# EAGLE schematic clock (EAGLE 6.1)
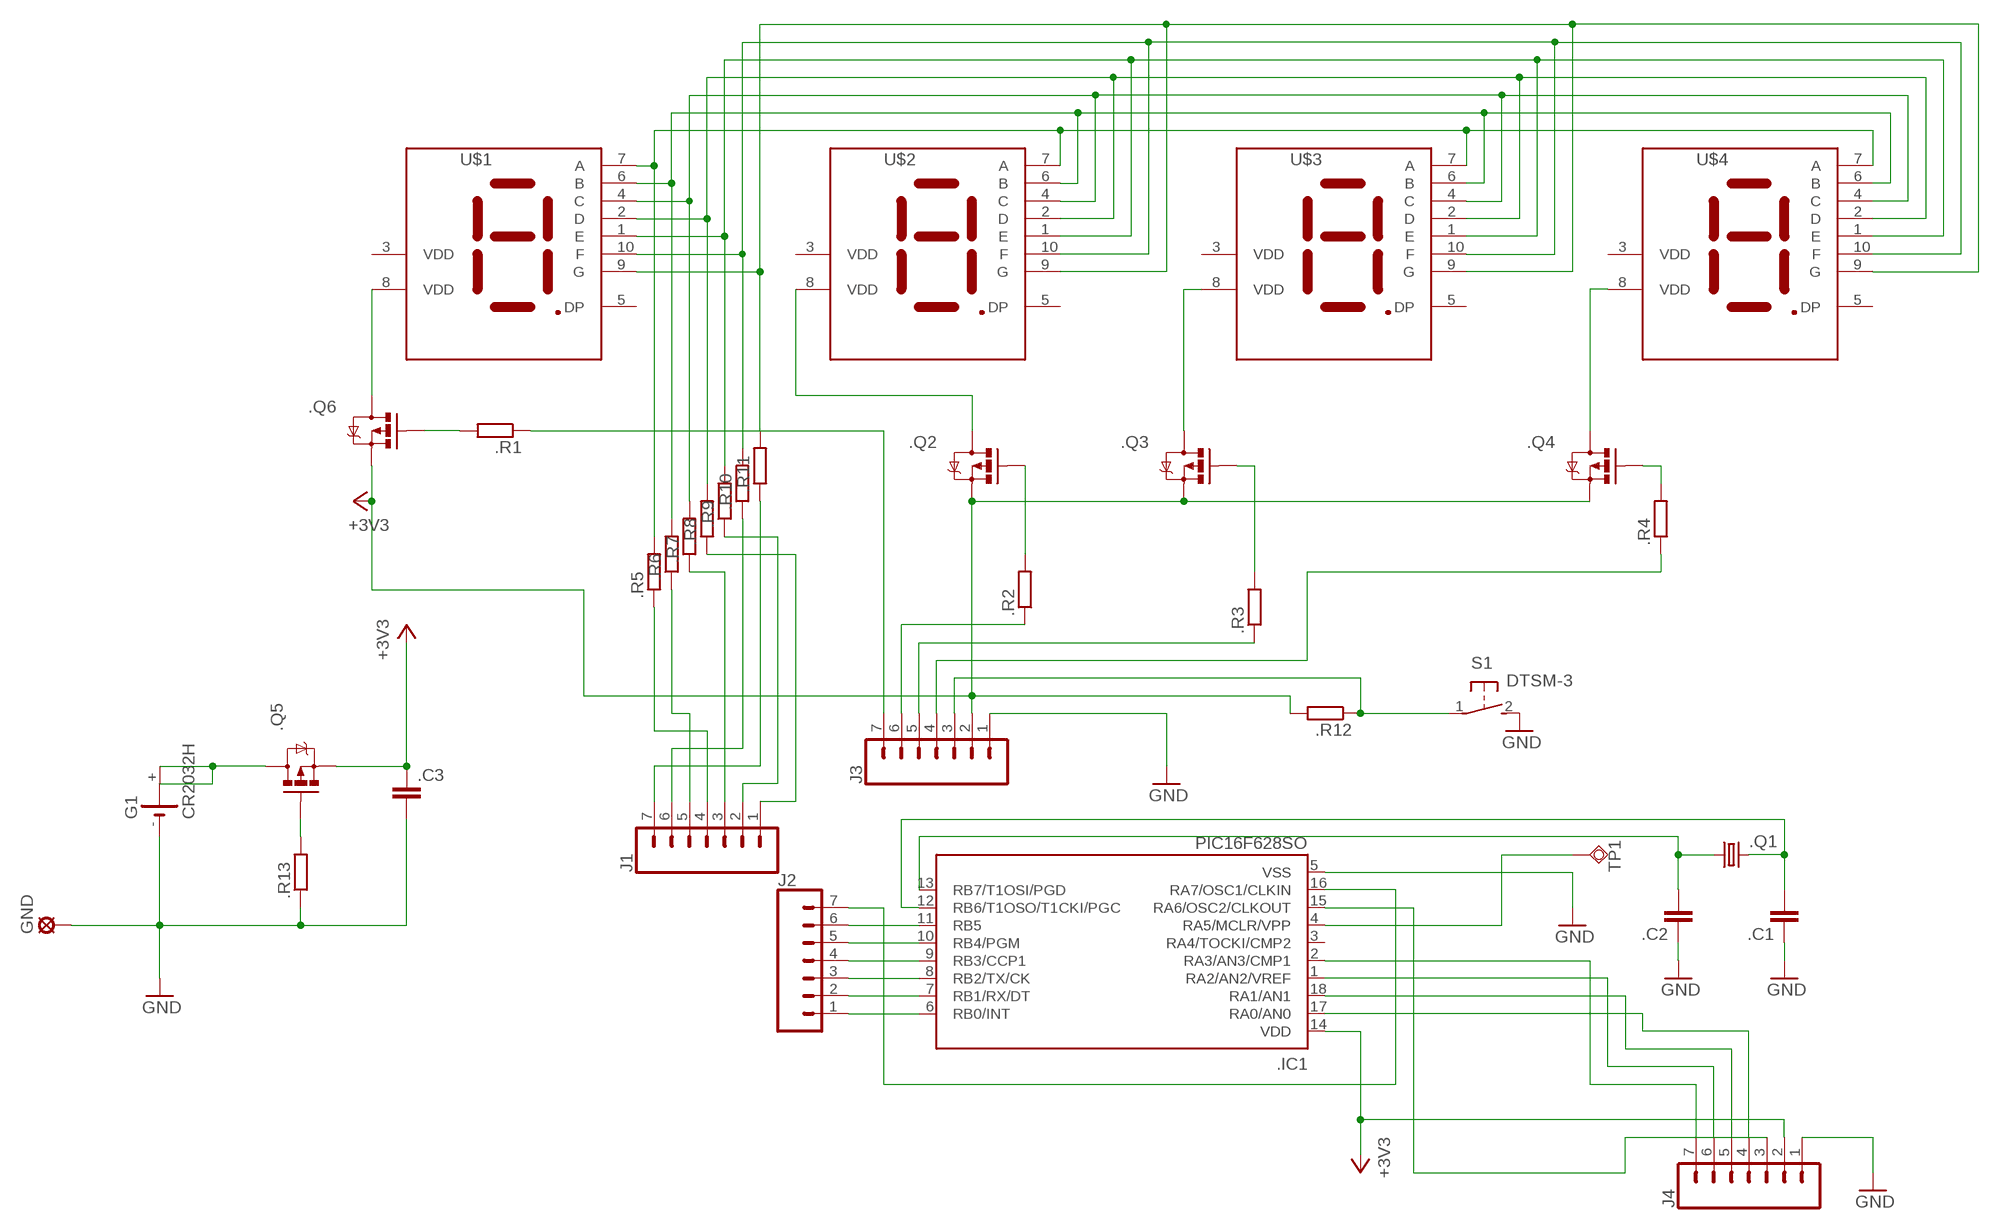
[diagram p0: schematic, sheet 1]

## Parts
.C1  C-EUC0805  [C0805]
.C2  C-EUC0805  [C0805]
.C3  C-EUC0805  [C0805]
.IC1  PIC16F628SO  [SO-18W]
.Q1  CRYSTALTC26H  [TC26H]
.Q2  MOSFET-PCHANNEL  [SOT23]
.Q3  MOSFET-PCHANNEL  [SOT23]
.Q4  MOSFET-PCHANNEL  [SOT23]
.Q5  MOSFET-PCHANNEL  [SOT23]
.Q6  MOSFET-PCHANNEL  [SOT23]
.R1  R-EU_R0805  [R0805]
.R2  R-EU_R0805  [R0805]
.R3  R-EU_R0805  [R0805]
.R4  R-EU_R0805  [R0805]
.R5  R-EU_R0805  [R0805]
.R6  R-EU_R0805  [R0805]
.R7  R-EU_R0805  [R0805]
.R8  R-EU_R0805  [R0805]
.R9  R-EU_R0805  [R0805]
.R10  R-EU_R0805  [R0805]
.R11  R-EU_R0805  [R0805]
.R12  R-EU_R0805  [R0805]
.R13  R-EU_R0805  [R0805]
G1  CR2032H  [CR2032H]
GND  SE14  [SE14]
J1  CONN_07  [1X07]
J2  CONN_07  [1X07]
J3  CONN_07  [1X07]
J4  CONN_07  [1X07]
S1  DTSM-3  [DTSM-3]
TP1  TPSQTP15R  [TP15R]
U$1  AL304G  [AL304G]
U$2  AL304G  [AL304G]
U$3  AL304G  [AL304G]
U$4  AL304G  [AL304G]

## Nets
+3V3: .Q2.2(S) .Q3.2(S) .Q4.2(S) .Q6.2(S) .R12.2 J3.2
GND: .C1.1 .C2.1 .C3.2 .IC1.5(VSS) .R13.1 G1.- GND.MP J3.1 J4.1 S1.2
MASK: .C3.1 .IC1.14(VDD) .Q5.2(S) J4.2 ; supply symbol labelled +3V3
N$1: .R5.2 U$1.7(A) U$2.7(A) U$3.7(A) U$4.7(A)
N$2: .R6.2 U$1.6(B) U$2.6(B) U$3.6(B) U$4.6(B)
N$3: .R7.2 U$1.4(C) U$2.4(C) U$3.4(C) U$4.4(C)
N$4: .R8.2 U$1.2(D) U$2.2(D) U$3.2(D) U$4.2(D)
N$5: .R9.2 U$1.1(E) U$2.1(E) U$3.1(E) U$4.1(E)
N$6: .R10.2 U$1.10(F) U$2.10(F) U$3.10(F) U$4.10(F)
N$7: .Q6.3(D) U$1.8(VDD)
N$8: .Q2.3(D) U$2.8(VDD)
N$9: .R11.2 U$1.9(G) U$2.9(G) U$3.9(G) U$4.9(G)
N$10: .Q3.3(D) U$3.8(VDD)
N$11: .C2.2 .IC1.13(RB7/T1OSI/PGD) .Q1.1
N$12: .C1.2 .IC1.12(RB6/T1OSO/T1CKI/PGC) .Q1.2
N$13: .Q4.3(D) U$4.8(VDD)
N$14: .R5.1 J1.4
N$15: .IC1.6(RB0/INT) J2.1
N$16: .IC1.7(RB1/RX/DT) J2.2
N$17: .IC1.8(RB2/TX/CK) J2.3
N$18: .IC1.9(RB3/CCP1) J2.4
N$19: .R6.1 J1.5
N$20: .R10.1 J1.6
N$21: .R11.1 J1.7
N$22: .R7.1 J1.3
N$23: .R9.1 J1.2
N$24: .R8.1 J1.1
N$25: .R1.1 J3.7
N$26: .R2.1 J3.6
N$27: .R3.1 J3.5
N$28: .R4.1 J3.4
N$29: .R12.1 J3.3 S1.1
N$30: .IC1.10(RB4/PGM) J2.5
N$31: .IC1.11(RB5) J2.6
N$32: .IC1.16(RA7/OSC1/CLKIN) J2.7
N$33: .Q6.1(G) .R1.2
N$36: .Q3.1(G) .R3.2
N$37: .IC1.17(RA0/AN0) J4.4
N$38: .IC1.18(RA1/AN1) J4.5
N$39: .IC1.1(RA2/AN2/VREF) J4.6
N$40: .IC1.2(RA3/AN3/CMP1) J4.7
N$41: .IC1.15(RA6/OSC2/CLKOUT) J4.3
N$42: .Q2.1(G) .R2.2
N$43: .Q4.1(G) .R4.2
N$45: .IC1.4(RA5/MCLR/VPP) TP1.TP
N$47: .Q5.3(D) G1.+ G1.+@1(+)
N$48: .Q5.1(G) .R13.2
Unconnected: .IC1.3(RA4/TOCKI/CMP2) U$1.3(VDD) U$1.5(DP) U$2.3(VDD) U$2.5(DP) U$3.3(VDD) U$3.5(DP) U$4.3(VDD) U$4.5(DP)

## Library data of the parts
.C1-.C3 = rcl:C-EU: CAPACITOR, European symbol
.IC1 = microchip:PIC16F62*: FLASH-Based 8-Bit CMOS Microcontroller Source: http://ww1.microchip.com/downloads/en/DeviceDoc/40300C.pdf; MF: MICROCHIP; MPN: PIC16F628-20I/SO; OC_FARNELL: 9760415; OC_NEWARK: 23C4986
.Q1 = crystal:CRYSTAL: CRYSTAL; OC_FARNELL: unknown; OC_NEWARK: unknown
.Q2-.Q6 = SparkFun:MOSFET-PCHANNEL
.R1-.R13 = rcl:R-EU_: RESISTOR, European symbol
G1 = battery:CR2032H: LI BATTERY Varta
GND = solpad:SE14: SOLDER PAD E1553, drill 1,4mm, distributor Buerklin, 07F820
J1-J4 = SparkFun-Connectors:CONN_07: Multi connection point. Often used as Generic Header-pin footprint for 0.1 inch spaced/style header connections On any of the 0.1 inch spaced packages, you can populate with these: Break Away Headers - Straight <https://www.sparkfun.com/products/116> (PRT-00116) Break Away Male Headers - Right Angle <https://www.sparkfun.com/products/553> (PRT-00553) Female Headers <https://www.sparkfun.com/products/115> (PRT-00115) Break Away Headers - Machine Pin <https://www.sparkfun.com/products/117> (PRT-00117) Break Away Female Headers - Swiss Machine Pin <https://www.sparkfun.com/products/743> (PRT-00743) For SCREWTERMINALS and SPRING TERMINALS visit here: Screw Terimnals on SparkFun.com <https://www.sparkfun.com/search/results?term=Screw+Terminals> (5mm/3.5mm/2.54mm spacing) This device is also useful as a general connection point to wire up your design to another part of your project. Our various solder wires solder well into these plated through hole pads. Hook-Up Wire - Assortment (Stranded, 22 AWG) <https://www.sparkfun.com/products/11375> (PRT-11375) Hook-Up Wire - Assortment (Solid Core, 22 AWG) <https://www.sparkfun.com/products/11367> (PRT-11367) View the entire wire category on our website here <https://www.sparkfun.com/categories/141> Special notes: Molex polarized connector foot print use with SKU : PRT-08231 with associated crimp pins and housings. 1MM SMD Version SKU: PRT-10208 NOTES ON THE VARIANTS LOCK and LOCK_LONGPADS... This footprint was designed to help hold the alignment of a through-hole component (i.e. 6-pin header) while soldering it into place. You may notice that each hole has been shifted either up or down by 0.005 of an inch from it's more standard position (which is a perfectly straight line). This slight alteration caused the pins (the squares in the middle) to touch the edges of the holes. Because they are alternating, it causes a "brace" to hold the component in place. 0.005 has proven to be the perfect amount of "off-center" position when using our standard breakaway headers. Although looks a little odd when you look at the bare footprint, once you have a header in there, the alteration is very hard to notice. Also,if you push a header all the way into place, it is covered up entirely on the bottom side.
S1 = switch-tact:DTSM-3
TP1 = testpad:TPSQ: Test pad
U$1-U$4 = al304g:AL304G